# EAGLE design Breakout (EAGLE 6.5.0)
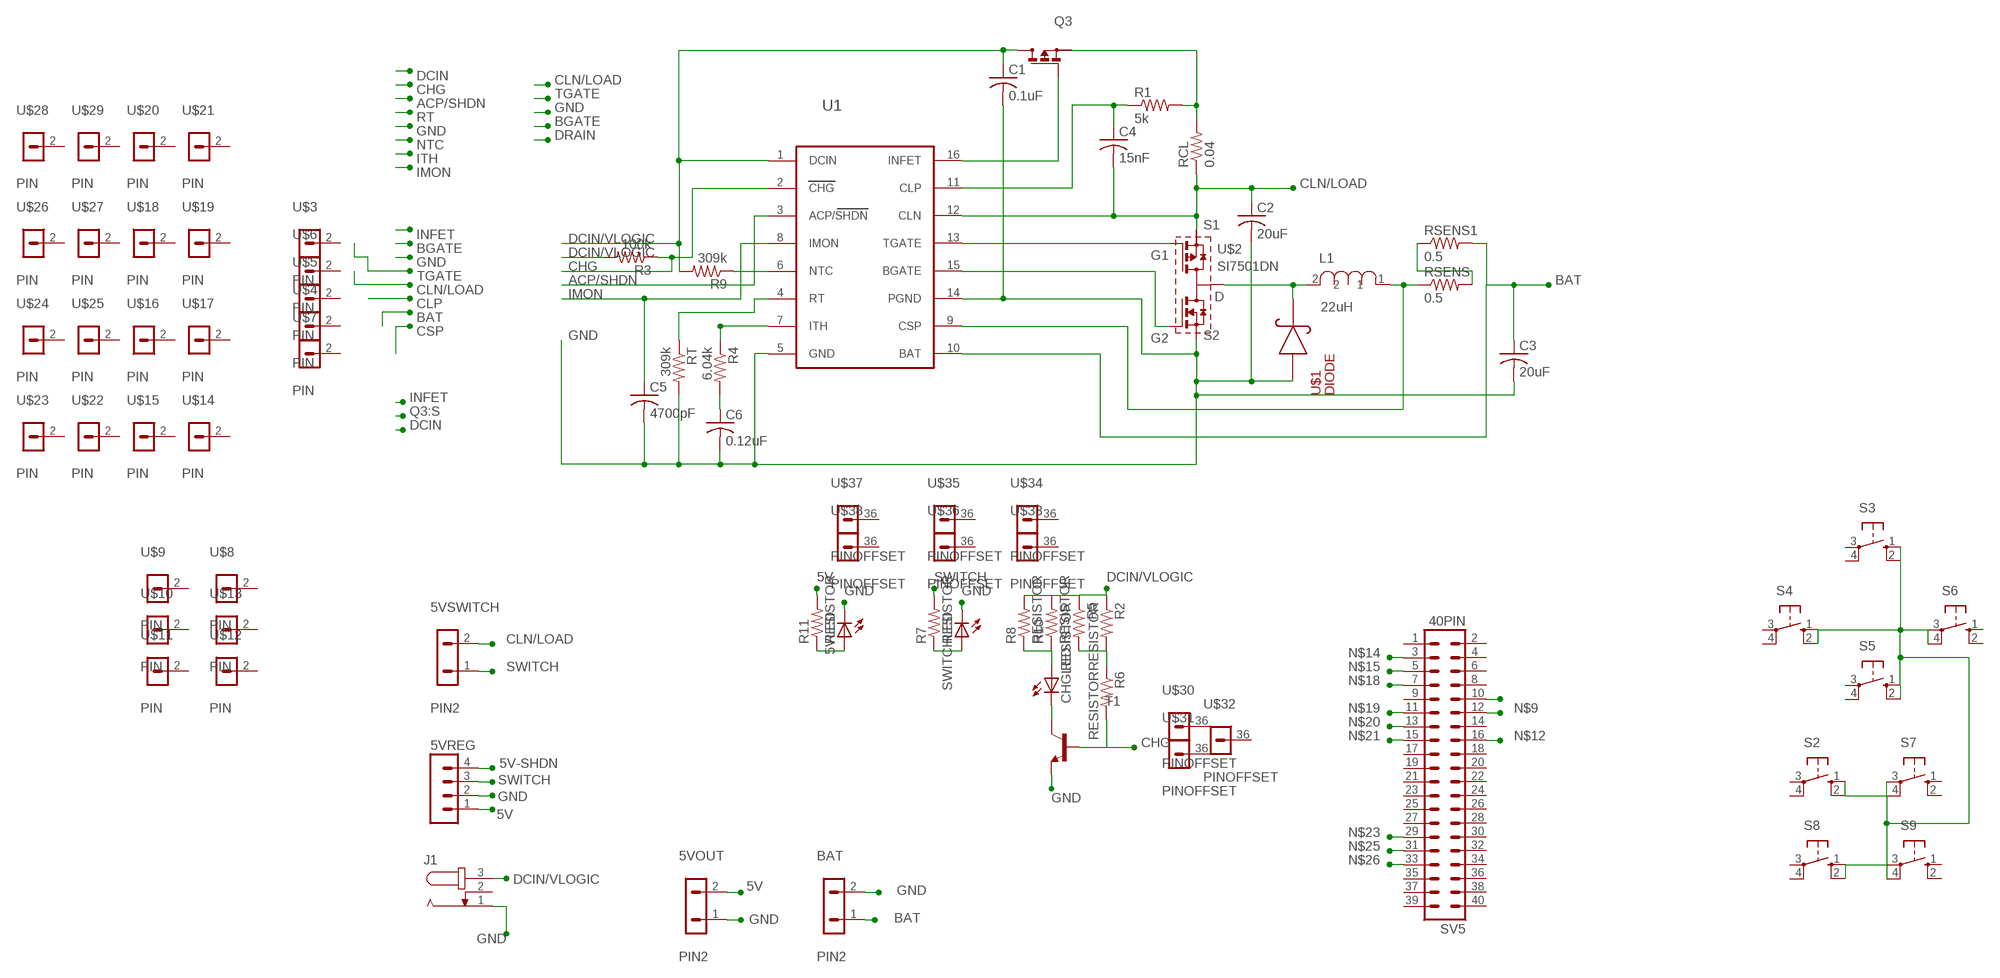
[diagram p0: schematic, sheet 1]

## Parts
5VLED  LED5MM  [LED5MM]
5VOUT  PIN2  [PIN2]
5VREG  MA04-1  [MA04-1]
5VSWITCH  PIN2  [PIN2]
BAT  PIN2  [PIN2]
C1  0.1uF  C-USC1210  [C1210]
C2  20uF  C-USC1210  [C1210]
C3  20uF  C-USC1210  [C1210]
C4  15nF  C-USC1210  [C1210]
C5  4700pF  C-USC1210  [C1210]
C6  0.12uF  C-USC1210  [C1210]
CHGLED  LED5MM  [LED5MM]
J1  JACK-PLUG0  [SPC4077]
L1  22uH  SDR1005INDUCTOR  [POWERINDUCTOR]
Q3  MOSFET  [SOT-23]
R1  5k  R-US_R1206  [R1206]
R2  RESISTOR  [RESISTOR]
R3  100k  R-US_R1206  [R1206]
R4  6.04k  R-US_R1206  [R1206]
R5  RESISTOR  [RESISTOR]
R6  RESISTOR  [RESISTOR]
R7  RESISTOR  [RESISTOR]
R8  RESISTOR  [RESISTOR]
R9  309k  R-US_R1206  [R1206]
R10  RESISTOR  [RESISTOR]
R11  RESISTOR  [RESISTOR]
RCL  0.04  R-US_R1206  [R1206]
RSENS  0.5  0612/1632  [0612/1632]
RSENS1  0.5  0612/1632  [0612/1632]
RT  309k  R-US_R1206  [R1206]
S2  10-XX  [B3F-10XX]
S3  10-XX  [B3F-10XX]
S4  10-XX  [B3F-10XX]
S5  10-XX  [B3F-10XX]
S6  10-XX  [B3F-10XX]
S7  10-XX  [B3F-10XX]
S8  10-XX  [B3F-10XX]
S9  10-XX  [B3F-10XX]
SV5  40PIN  [40PINHEADDER]
SWITCHLED  LED5MM  [LED5MM]
T1  -NPN-TO92-E1  [TO92-E1]
U1  LTC6004  [SSOP-16]
U$1  DIODE  [DIODE]
U$2  SI7501DN  [POWERPAK]
U$3  PIN  [PIN]
U$4  PIN  [PIN]
U$5  PIN  [PIN]
U$6  PIN  [PIN]
U$7  PIN  [PIN]
U$8  PIN  [PIN]
U$9  PIN  [PIN]
U$10  PIN  [PIN]
U$11  PIN  [PIN]
U$12  PIN  [PIN]
U$13  PIN  [PIN]
U$14  PIN  [PIN]
U$15  PIN  [PIN]
U$16  PIN  [PIN]
U$17  PIN  [PIN]
U$18  PIN  [PIN]
U$19  PIN  [PIN]
U$20  PIN  [PIN]
U$21  PIN  [PIN]
U$22  PIN  [PIN]
U$23  PIN  [PIN]
U$24  PIN  [PIN]
U$25  PIN  [PIN]
U$26  PIN  [PIN]
U$27  PIN  [PIN]
U$28  PIN  [PIN]
U$29  PIN  [PIN]
U$30  PINOFFSET  [PINOFFST]
U$31  PINOFFSET  [PINOFFST]
U$32  PINOFFSET  [PINOFFST]
U$33  PINOFFSET  [PINOFFST]
U$34  PINOFFSET  [PINOFFST]
U$35  PINOFFSET  [PINOFFST]
U$36  PINOFFSET  [PINOFFST]
U$37  PINOFFSET  [PINOFFST]
U$38  PINOFFSET  [PINOFFST]

## Nets
5V: 5VOUT.2 5VREG.1 R11.1
5V-SHDN: 5VREG.4
ACP/SHDN: U1.3(ACP/SHDN)
BAT: BAT.1 C3.1 RSENS1.2 U1.10(BAT)
BGATE: U1.15(BGATE) U$2.G2
CHG: R3.1 R6.1 T1.2(B) U1.2(CHG)
CLN/LOAD: 5VSWITCH.2 C2.1 C4.2 RCL.1 U1.12(CLN) U$2.S1
CLP: C4.1 R1.1 U1.11(CLP)
CSP: L1.1 RSENS.1 U1.9(CSP)
DCIN/VLOGIC: C1.1 J1.3 Q3.DRAIN(D) R2.2 R3.2 R5.2 R8.1 R9.2 R10.1 U1.1(DCIN)
DRAIN: L1.2 U$1.P$1 U$2.D
GND: 5VLED.K(C) 5VOUT.1 5VREG.2 BAT.2 C1.2 C2.2 C3.2 C5.2 C6.2 J1.1 RT.2 S2.1(S) S2.2(S1) S3.1(S) S3.2(S1) S4.1(S) S4.2(S1) S5.1(S) S5.2(S1) S6.3(P) S6.4(P1) S7.3(P) S7.4(P1) S8.1(S) S8.2(S1) S9.3(P) S9.4(P1) SWITCHLED.K(C) T1.3(E) U1.5(GND) U1.14(PGND) U$1.P$2 U$2.S2
IMON: C5.1 U1.8(IMON)
INFET: Q3.GATE(G) U1.16(INFET)
ITH: R4.1 U1.7(ITH)
N$1: RSENS1.1 RSENS.2
N$6: R2.1 R5.1 R6.2
N$9: SV5.12
N$10: CHGLED.A R8.2 R10.2
N$11: C6.1 R4.2
N$12: SV5.16
N$13: R7.2 SWITCHLED.A
N$14: SV5.3
N$15: SV5.5
N$16: CHGLED.K(C) T1.1(C)
N$17: 5VLED.A R11.2
N$18: SV5.7
N$19: SV5.11
N$20: SV5.13
N$21: SV5.15
N$23: SV5.29
N$24: SV5.10
N$25: SV5.31
N$26: SV5.33
NTC: R9.1 U1.6(NTC)
Q3:S: Q3.SOURCE(S) R1.2 RCL.2
RT: RT.1 U1.4(RT)
SWITCH: 5VREG.3 5VSWITCH.1 R7.1
TGATE: U1.13(TGATE) U$2.G1
Unconnected: J1.2 S2.3(P) S2.4(P1) S3.3(P) S3.4(P1) S4.3(P) S4.4(P1) S5.3(P) S5.4(P1) S6.1(S) S6.2(S1) S7.1(S) S7.2(S1) S8.3(P) S8.4(P1) S9.1(S) S9.2(S1) SV5.1 SV5.2 SV5.4 SV5.6 SV5.8 SV5.9 SV5.14 SV5.17 SV5.18 SV5.19 SV5.20 SV5.21 SV5.22 SV5.23 SV5.24 SV5.25 SV5.26 SV5.27 SV5.28 SV5.30 SV5.32 SV5.34 SV5.35 SV5.36 SV5.37 SV5.38 SV5.39 SV5.40 U$3.2 U$4.2 U$5.2 U$6.2 U$7.2 U$8.2 U$9.2 U$10.2 U$11.2 U$12.2 U$13.2 U$14.2 U$15.2 U$16.2 U$17.2 U$18.2 U$19.2 U$20.2 U$21.2 U$22.2 U$23.2 U$24.2 U$25.2 U$26.2 U$27.2 U$28.2 U$29.2 U$30.36 U$31.36 U$32.36 U$33.36 U$34.36 U$35.36 U$36.36 U$37.36 U$38.36

## Library data of the parts
5VLED CHGLED SWITCHLED = led:LED: LED OSRAM: - CHIPLED LG R971, LG N971, LY N971, LG Q971, LY Q971, LO R971, LY R971 LH N974, LH R974 LS Q976, LO Q976, LY Q976 LO Q996 - Hyper CHIPLED LW Q18S LB Q993, LB Q99A, LB R99A - SideLED LS A670, LO A670, LY A670, LG A670, LP A670 LB A673, LV A673, LT A673, LW A673 LH A674 LY A675 LS A676, LA A676, LO A676, LY A676, LW A676 LS A679, LY A679, LG A679 - Hyper Micro SIDELED® LS Y876, LA Y876, LO Y876, LY Y876 LT Y87S - SmartLED LW L88C, LW L88S LB L89C, LB L89S, LG L890 LS L89K, LO L89K, LY L89K LS L896, LA L896, LO L896, LY L896 - TOPLED LS T670, LO T670, LY T670, LG T670, LP T670 LSG T670, LSP T670, LSY T670, LOP T670, LYG T670 LG T671, LOG T671, LSG T671 LB T673, LV T673, LT T673, LW T673 LH T674 LS T676, LA T676, LO T676, LY T676, LB T676, LH T676, LSB T676, LW T676 LB T67C, LV T67C, LT T67C, LS T67K, LO T67K, LY T67K, LW E67C LS E67B, LA E67B, LO E67B, LY E67B, LB E67C, LV E67C, LT E67C LW T67C LS T679, LY T679, LG T679 LS T770, LO T770, LY T770, LG T770, LP T770 LB T773, LV T773, LT T773, LW T773 LH T774 LS E675, LA E675, LY E675, LS T675 LS T776, LA T776, LO T776, LY T776, LB T776 LHGB T686 LT T68C, LB T68C - Hyper Mini TOPLED® LB M676 - Mini TOPLED Santana® LG M470 LS M47K, LO M47K, LY M47K Source: http://www.osram.convergy.de LUXEON: - LUMILED® LXK2-PW12-R00, LXK2-PW12-S00, LXK2-PW14-U00, LXK2-PW14-V00 LXK2-PM12-R00, LXK2-PM12-S00, LXK2-PM14-U00 LXK2-PE12-Q00, LXK2-PE12-R00, LXK2-PE12-S00, LXK2-PE14-T00, LXK2-PE14-U00 LXK2-PB12-K00, LXK2-PB12-L00, LXK2-PB12-M00, LXK2-PB14-N00, LXK2-PB14-P00, LXK2-PB14-Q00 LXK2-PR12-L00, LXK2-PR12-M00, LXK2-PR14-Q00, LXK2-PR14-R00 LXK2-PD12-Q00, LXK2-PD12-R00, LXK2-PD12-S00 LXK2-PH12-R00, LXK2-PH12-S00 LXK2-PL12-P00, LXK2-PL12-Q00, LXK2-PL12-R00 Source: www.luxeon.com KINGBRIGHT: KA-3528ASYC Source: www.kingbright.com
5VOUT 5VSWITCH BAT = Custom:PIN2
5VREG = con-lstb:MA04-1: PIN HEADER; OC_FARNELL: unknown; OC_NEWARK: unknown
C1-C6 = resistor:C-US: CAPACITOR, American symbol
J1 = con-jack:JACK-PLUG: DC POWER JACK Power Jack, DC, Right Angle, Through Hole, Rated 5A at 16VDC, PC Terminals Distributor: Farnell (www.Farnell.de) Drawing: 84N1161.pdf / 84N1162.pdf Manufacturer: SPC Technology (www.spctechnology.com) Type: SPC4077 / SPC 4078; OC_FARNELL: unknown; OC_NEWARK: unknown
L1 = Custom:SDR1005INDUCTOR
Q3 = Custom:MOSFET
R1 R3 R4 R9 RCL RT = resistor:R-US_: RESISTOR, American symbol
R2 R5-R8 R10 R11 = Custom:RESISTOR
RSENS RSENS1 = Custom:0612/1632
S2-S9 = switch-omron:10-XX: OMRON SWITCH; MPN: B3F-1000; OC_FARNELL: 176432; OC_NEWARK: 36M3542
SV5 = Custom:40PIN
T1 = transistor:*-NPN-: NPN Transistror BF959 corrected 2008.03.06
U1 = Custom:LTC6004
U$1 = Custom:DIODE
U$2 = Custom:SI7501DN
U$3-U$29 = Custom:PIN
U$30-U$38 = Custom:PINOFFSET

## Board
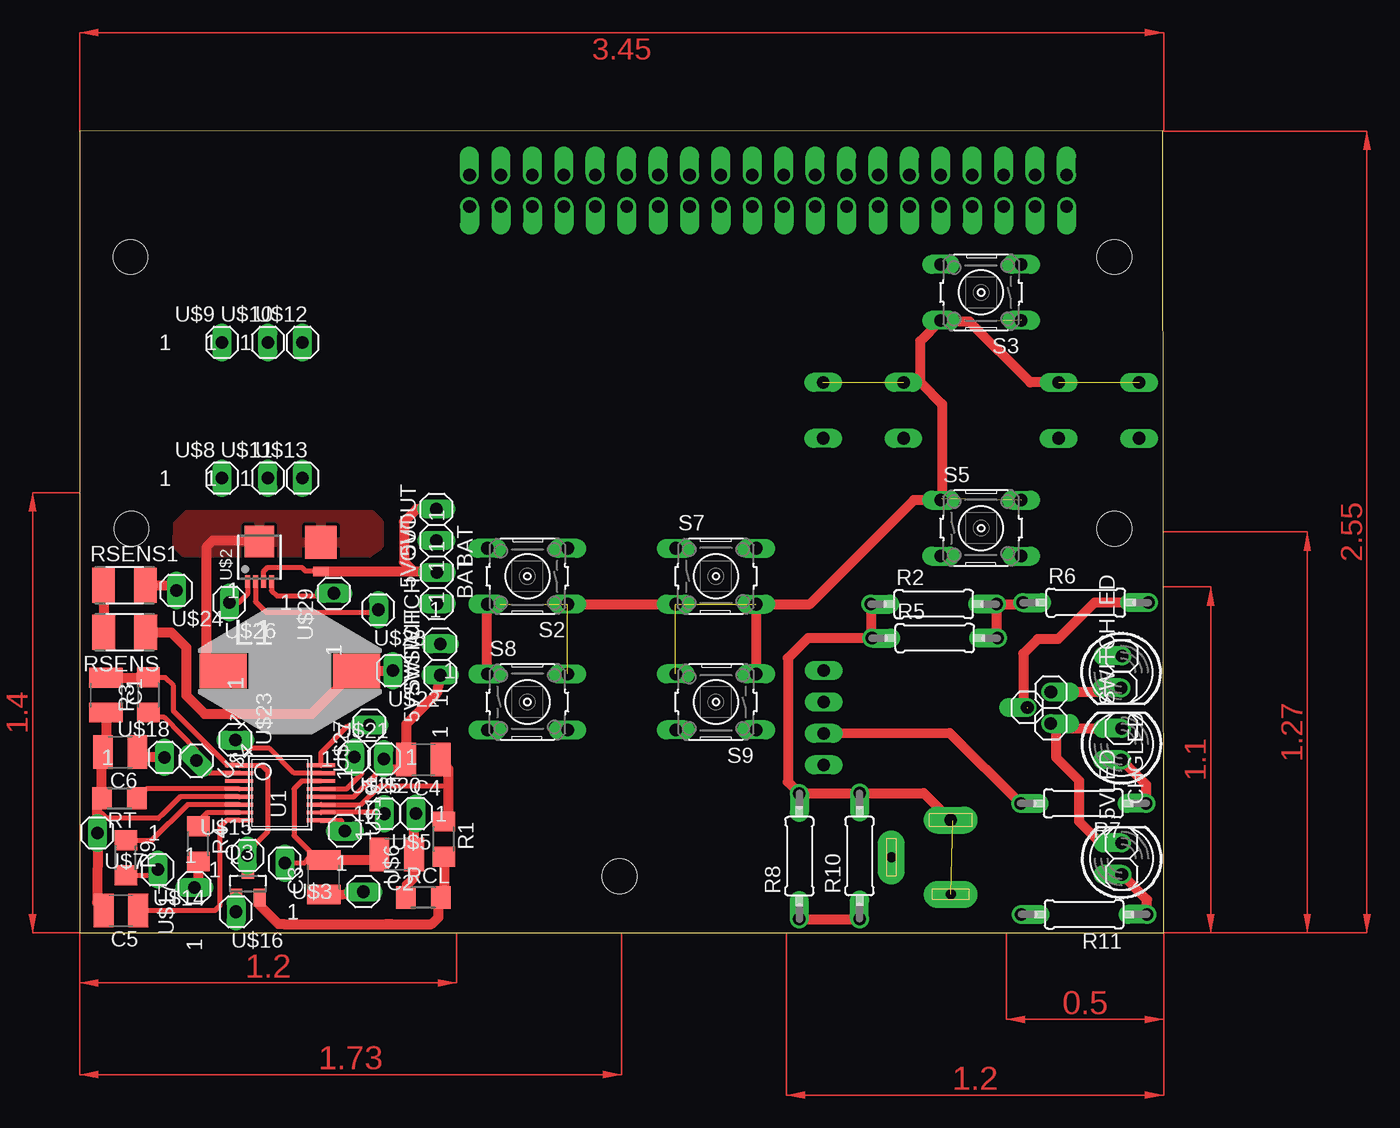
[diagram p1: board, top side]
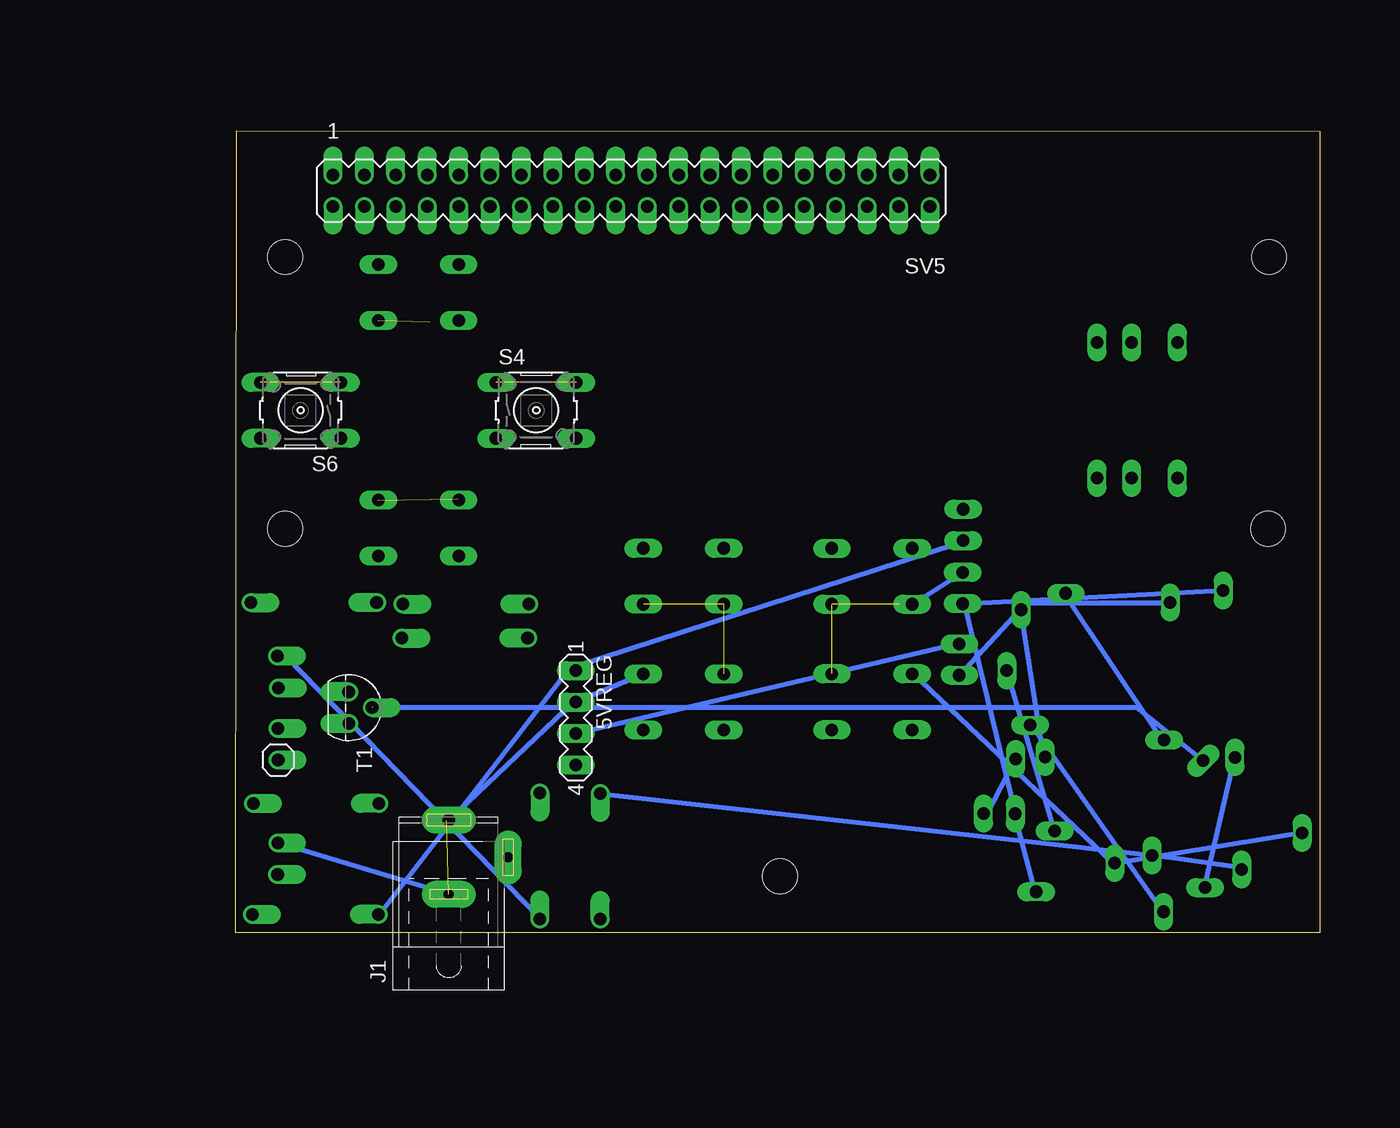
[diagram p2: board, bottom side, seen from below]

Size 87.63 x 64.8 mm. Coordinates in mm from the lower left corner, seen from the top.
Outline: 0,0 87.63,0 87.58,64.8 0,64.77 0,0
Copper layers (1*16): Top 0.035mm / dielectric 1.5mm / Bottom 0.035mm
Design rules "default": minimum track width 10mil, minimum drill 24mil, track to track 8mil, track to pad 8mil, pad to pad 8mil, via to via 8mil, smd to smd 8mil, copper to edge 40mil, drill to drill 8mil, minimum pad ring 10mil, minimum via ring 8mil, stop-mask expansion 4mil, vias tented up to drill 0mil, thermal gap 10mil
Holes 2.79 mm at 4.18,32.64 83.64,32.64 43.65,4.56 4.1,54.61 83.64,54.61

### Footprints (pad centres in the part's own frame; a part is rotated, then mirrored left to right if it is on the bottom)
LED5MM = drill 0.813 octagon: A -1.27,0; K 1.27,0
PIN2 = drill 1.016 long: 1 1.27,0; 2 -1.27,0
MA04-1 = drill 1.016 long: 1 -3.81,0; 2 -1.27,0; 3 1.27,0; 4 3.81,0
C1210 = smd 1.6 x 2.7: 1 -1.4,0; 2 1.4,0
SPC4077 = drill 0.8 pad 2.184 long: 1 -3,0; 2 0,-4.8 | drill 1 pad 2.184 long: 3 3,0
POWERINDUCTOR = smd 3.81 x 2.794: 1 5.397,0; 2 -5.397,0
SOT-23 = smd 1 x 1.4: DRAIN 0,1.1; GATE -0.95,-1.1; SOURCE 0.95,-1.1
R1206 = smd 1.6 x 1.803: 1 -1.422,0; 2 1.422,0
RESISTOR = drill 1.016 offset: 1 5.08,0; 2 -5.08,0
0612/1632 = smd 1.84 x 2.8: 1 -1.7,0; 2 1.7,0
B3F-10XX = drill 1.016 long: 1 -3.251,2.261; 2 3.251,2.261; 3 -3.251,-2.261; 4 3.251,-2.261
40PINHEADDER = drill 1.016 offset: 1 -21.59,-1.27; 2 21.59,1.27; 3 -24.13,-1.27; 4 24.13,1.27; 5 -19.05,-1.27; 6 19.05,1.27; 7 -16.51,-1.27; 8 16.51,1.27; 9 -13.97,-1.27; 10 13.97,1.27; 11 -11.43,-1.27; 12 11.43,1.27; 13 -8.89,-1.27; 14 8.89,1.27; 15 -6.35,-1.27; 16 6.35,1.27; 17 -3.81,-1.27; 18 3.81,1.27; 19 -1.27,-1.27; 20 1.27,1.27; 21 1.27,-1.27; 22 -1.27,1.27; 23 3.81,-1.27; 24 -3.81,1.27; 25 6.35,-1.27; 26 -6.35,1.27; 27 8.89,-1.27; 28 -8.89,1.27; 29 11.43,-1.27; 30 -11.43,1.27; 31 13.97,-1.27; 32 -13.97,1.27; 33 16.51,-1.27; 34 -16.51,1.27; 35 19.05,-1.27; 36 -19.05,1.27; 37 21.59,-1.27; 38 -21.59,1.27; 39 24.13,-1.27; 40 -24.13,1.27
TO92-E1 = drill 0.813 octagon: 1 -1.27,0; 2 0,1.905; 3 1.27,0
SSOP-16 = smd 2.286 x 0.305: 1 -3.302,2.349; 2 -3.302,1.714; 3 -3.302,1.079; 4 -3.302,0.444; 5 -3.302,-0.191; 6 -3.302,-0.826; 7 -3.302,-1.461; 8 -3.302,-2.096; 9 3.302,-2.096; 10 3.302,-1.461; 11 3.302,-0.826; 12 3.302,-0.191; 13 3.302,0.444; 14 3.302,1.079; 15 3.302,1.714; 16 3.302,2.349
DIODE = smd 2.667 x 2.54: P$1 -1.638,0 | smd 0.762 x 1.27: P$2 0.699,0
POWERPAK = smd 2.4 x 2.54: D 0,1.27 | smd 0.4 x 1.016: G1 -0.325,-1.976; G2 0.975,-1.976; S1 -0.975,-1.976; S2 0.325,-1.976
PIN = drill 1.016 long: 2 0,0
PINOFFST = drill 1.016 offset: 36 0,0

### Placement (x,y rotation side)
5VLED  84.24,5.99 90 top
5VOUT  28.85,32.95 90 top
5VREG  60.15,17.37 270 bottom
5VSWITCH  29.14,22.08 90 top
BAT  28.87,27.85 270 top
C1  2.14,19.2 270 top
C2  25.63,6.33 180 top
C3  19.73,4.48 90 top
C4  27.78,13.98 180 top
C5  3.34,1.78 180 top
C6  3.28,14.59 180 top
CHGLED  84.19,21.04 270 top
J1  70.42,6.09 90 bottom
L1  16.99,21.14 0 top
Q3  13.6,3.95 0 top
R1  29.44,7.56 270 top
R2  69.04,26.56 0 top
R3  5.56,19.22 90 top
R4  9.6,7.18 270 top
R5  69.13,23.81 0 top
R6  81.33,26.67 0 top
R7  81.13,10.45 180 top
R8  58.18,6.18 90 top
R9  3.74,6.05 270 top
R10  63.05,6.2 90 top
R11  81.2,1.48 180 top
RCL  27.78,2.84 0 top
RSENS  3.65,24.28 180 top
RSENS1  3.63,28.08 0 top
RT  3.22,10.87 180 top
S2  36.2,28.81 180 top
S3  72.87,51.74 180 top
S4  63.35,42.22 0 bottom
S5  72.87,32.69 0 top
S6  82.4,42.22 180 bottom
S7  51.44,28.81 0 top
S8  36.2,18.65 0 top
S9  51.44,18.65 180 top
SV5  55.65,59.97 180 bottom
SWITCHLED  84.22,15.23 90 top
T1  78.51,18.19 270 bottom
U1  16.2,11.17 0 top
U$1  19.51,29.9 270 top
U$2  14.54,30.34 0 top
U$3  16.58,5.62 180 top
U$4  9.42,13.9 225 top
U$5  24.63,9.61 180 top
U$6  22.93,3.31 270 top
U$7  1.42,8.07 180 top
U$8  11.51,36.73 0 top
U$9  11.51,47.7 0 top
U$10  15.21,47.7 0 top
U$11  15.21,36.73 0 top
U$12  18.01,47.7 0 top
U$13  18.01,36.73 0 top
U$14  6.32,5.1 180 top
U$15  13.56,6.25 0 top
U$16  12.65,1.69 180 top
U$17  9.28,3.64 90 top
U$18  6.87,14.17 0 top
U$19  21.43,8.21 270 top
U$20  27.18,9.62 0 top
U$21  24.58,14.05 0 top
U$22  25.31,21.17 180 top
U$23  12.6,15.57 270 top
U$24  7.81,27.66 180 top
U$25  22.22,14.18 180 top
U$26  12.09,26.69 180 top
U$27  23.42,16.78 90 top
U$28  24.16,26.1 180 top
U$29  20.54,27.43 90 top
U$30  78.51,19.47 270 top
U$31  78.51,16.9 270 top
U$32  76.61,18.19 90 top
U$33  84.19,19.78 90 top
U$34  84.27,22.38 90 top
U$35  84.25,4.71 90 top
U$36  84.24,7.26 90 top
U$37  84.21,13.97 270 bottom
U$38  84.23,16.5 90 top

### Tracks (layer width: path | path; a pad name or v marks a point on that pad's centre or on a via)
5V
  Bottom 0.406: R11.1 75.95,1.53 60.6,21.42 60.48,21.04 5VREG.1 60.17,21.58 60.82,21.34 28.72,31.64 5VOUT.2
BAT  (via drill 0.6)
  Top 0.406: v24.61,9.75 19.53,9.74 U1.10
  Top 0.813: C3.1 22.96,3.15 v23.04,3.44 | RSENS1.2 7.36,28.08 v7.81,27.64
  Bottom 0.406: v23.04,3.44 24.68,9.64 v24.61,9.75 28.69,26.5 28.73,26.59 28.86,26.59 BAT.1 28.87,26.53 v7.81,27.64
BGATE  (via drill 0.6)
  Top 0.406: U$2.G2 15.52,27.65 15.95,27.22 20.35,27.22 v20.54,27.41 | U1.15 17.36,12.89 15.35,14.9 13.3,14.9 v12.64,15.56
  Bottom 0.406: v20.54,27.41 20.63,27.3 13.02,15.94 v12.64,15.56 12.58,15.5
CHG  (via drill 0.6)  (1 unrouted)
  Top 0.406: U1.2 11.4,12.89 10.35,12.89 | 10.35,12.89 9.98,13.36 9.41,14.72 6.87,17.39 6.83,17.39 5.94,17.41 R3.1 | 9.78,13.52 10.55,13.02 v9.42,13.91 10.12,13.2 10.35,12.89
  Top 0.813: R6.1 82.03,26.67 79.09,23.73 77.45,23.73 76.28,22.55 76.28,18.52 T1.2
  Bottom 0.406: 76.57,18.22 14.85,18.22 v9.42,13.91
CLN/LOAD  (via drill 0.6)
  Top 0.406: U1.12 22.14,10.98 24.36,13.21 24.73,13.21 24.62,13.32 v24.58,14.1 | 26.4,13.21 C4.2 | U$2.S1 13.57,27.38 12.89,26.7 12.17,26.7 v12.08,26.61
  Top 0.813: 26.45,3.1 26.65,2.91 26.23,2.49 RCL.1 26.46,2.94 26.46,3.88 27.03,4.46 C2.1 27.03,9.32 v27.18,9.62 | 24.73,13.21 26.4,13.21 | 5VSWITCH.2 28.85,19.32 26.39,16.86 26.39,13.99 C4.2
  Bottom 0.406: v27.18,9.62 27.05,9.32 v24.58,14.1 | v12.08,26.61 23.78,26.61 5VSWITCH.2
CLP
  Top 0.406: U1.11 22.71,10.35 24.3,11.88 29.86,11.87 29.79,13.21
  Top 0.813: C4.1 29.79,13.21 29.77,8.97 29.45,8.97 R1.1
CSP  (via drill 0.6)
  Top 0.406: U1.9 21.16,9.08 v21.43,8.17 | 21.53,20.56 L1.1
  Top 0.813: RSENS.1 7.4,24.28 8.62,23.06 8.62,19.18 10.11,17.69 18.78,17.69 22.23,21.14 L1.1 22.41,21.12 v25.21,21.12
  Bottom 0.406: v21.43,8.17 25.24,21.03 25.26,21.09 25.11,21.09 v25.21,21.12
DCIN/VLOGIC  (via drill 0.6)
  Top 0.406: R3.2 5.58,20.61 6.93,20.61 7.59,19.95 7.59,17.91 8,17.51 8,17.48 11.95,13.52 U1.1 14.71,13.52 15.18,13.05 15.18,8.16 13.71,6.68 v13.53,6.27 13.63,5.42 Q3.DRAIN | R9.2 5.86,4.63 v6.33,5.1
  Top 0.813: C1.1 4.69,20.6 5.05,20.96 5.24,20.96 R3.2 | J1.3 68.23,11.28 R10.1 63.02,11.26 R8.1 57.26,12.19 57.26,22.18 58.88,23.81 R5.2 63.96,23.89 R2.2
  Bottom 0.406: R8.1 58.1,11.25 13.53,6.25 v13.53,6.27 6.4,5.25 v6.33,5.1
DRAIN
  Top 0.813: L1.2 10.38,21.14 10.28,21.24 10.28,31.2 10.78,31.7 14.45,31.7 U$2.D
  pour Top: 15.29,30.74 23.4,30.74 24.21,31.33 24.21,33.12 23.59,33.74 8.69,33.74 7.91,32.95 7.87,31.33 8.44,30.76
GND  (via drill 0.6)  (9 unrouted)
  Top 0.406: U1.5 8.13,10.98 6.65,9.51 6.62,9.51 6.35,9.24 2.2,9.24 1.4,10.01 | U1.14 17.96,12.25 17.34,11.63 17.34,7.84 18.75,6.42 | C3.2 19.07,6.42 18.75,6.42 | 18.75,6.42 18.16,5.61 v16.68,5.62 | U$2.S2 14.87,29.21 15.19,29.53 17.95,29.53 18.24,29.25 19.47,29.25 U$1.P$2
  Top 0.813: S7.4 S9.3 | S8.1 S2.2 33.99,26.55 | S7.4 | C1.2 2.14,14.85 C6.2 1.79,14.51 RT.2 1.4,10.01 v1.47,8.03 1.4,2.45 C5.2 | C3.2 23.89,5.9 C2.2 | S3.2 70.46,49.48 | S4.1 67.95,44.48 | 67.95,44.48 69.72,42.71 69.72,35.05 S5.1 67.44,34.95 59.03,26.55 S7.4 | 67.95,44.48 67.95,47.81 S3.2 | S6.3 76.85,44.48 71.94,49.39 69.71,49.39 S3.2 | U$1.P$2 26.98,29.2 | 26.98,29.2 28.79,29.2 BAT.2 | 5VOUT.1 27.23,34.22 26.22,33.21 26.22,29.96 26.98,29.2 | SWITCHLED.K 78.92,16.5 | 78.92,16.5 T1.3 | 5VLED.K 82.53,7.26 80.78,9.01 80.78,12.32 78.92,14.18 78.92,16.5 | S2.1 S7.3
  Bottom 0.406: J1.1 84.03,7.2 5VLED.K | 70.61,9.03 70.6,9.18 70.45,9.05 60.28,18.65 5VREG.2 60.18,18.65 S9.3 | S2.2 32.86,26.56 BAT.2 | v1.47,8.03 1.34,8.12 v16.68,5.62 33.01,21.09 S8.1
IMON
  Top 0.406: U1.8 11.86,9.08 11.33,8.54 11.33,2.18 10.93,1.79 C5.1
INFET  (via drill 0.6)
  Top 0.406: v12.67,1.61 12.67,2.83 Q3.GATE | U1.16 19.5,14.53 21.68,16.71 23.34,16.71 v23.4,16.77
  Bottom 0.406: v23.4,16.77 23.37,16.8 v12.67,1.61
ITH
  Top 0.406: U1.7 10.32,9.71 9.39,8.78 9.39,8.76 R4.1
N$1
  Top 0.813: RSENS1.1 1.93,24.3 RSENS.2
N$2  (via drill 0.6 pad 0.81)
  other vias: 11.51,36.73
N$3  (via drill 0.6 pad 0.81)
  other vias: 15.21,36.73
N$4  (via drill 0.6 pad 0.81)
  other vias: 18.01,36.73
N$5  (via drill 0.6 pad 0.81)
  other vias: 11.51,47.7
N$6
  Top 0.813: R5.1 74.12,23.89 R2.1 76.14,26.55 R6.2
N$7  (via drill 0.6 pad 0.81)
  other vias: 15.21,47.7
N$8  (via drill 0.6 pad 0.81)
  other vias: 18.01,47.7
N$10
  Top 0.813: R8.2 63.02,1.1 R10.2
  Bottom 0.406: CHGLED.A 83.57,22.31 R10.2
N$11  (via drill 0.6)
  Top 0.813: R4.2 9.6,3.94 v9.27,3.62 | v6.86,14.17 5.1,14.17 C6.1
  Bottom 0.406: v9.27,3.62 9.34,3.57 v6.86,14.17
N$13
  Top 0.813: R7.2 86.22,11.97 SWITCHLED.A
N$16
  Top 0.813: T1.1 83.87,19.45 CHGLED.K
N$17
  Top 0.813: R11.2 86.28,2.67 5VLED.A
NTC
  Top 0.406: U1.6 8.71,10.35 5.79,7.43 3.79,7.43 R9.1
Q3:S
  Top 0.813: Q3.SOURCE 14.55,2.22 16.08,0.69 16.5,0.69 25.2,0.69 24.78,0.69 28.44,0.69 29,1.25 29,2.45 RCL.2 29.44,3.08 R1.2
RT
  Top 0.406: U1.4 5.39,11.62 RT.1
SWITCH
  Top 0.813: 5VREG.3 70.33,16.14 R7.1
  Bottom 0.406: 5VREG.3 28.87,23.48 28.93,23.33 29.17,23.2 5VSWITCH.1
TGATE  (via drill 0.6)
  Top 0.406: U1.13 21.58,11.62 22.81,12.85 22.24,13.42 v22.24,14.18 | U$2.G1 14.22,26.75 15.11,25.86 23.61,25.86 v24.19,26.12
  Bottom 0.406: v24.19,26.12 22.33,14.15 v22.24,14.18
(copper drawn outside any net)
  shapes: Top area x9